# Altium schematic sheet Radio.SchDoc
size A4; SheetNumber: 4; SheetTotal: 5
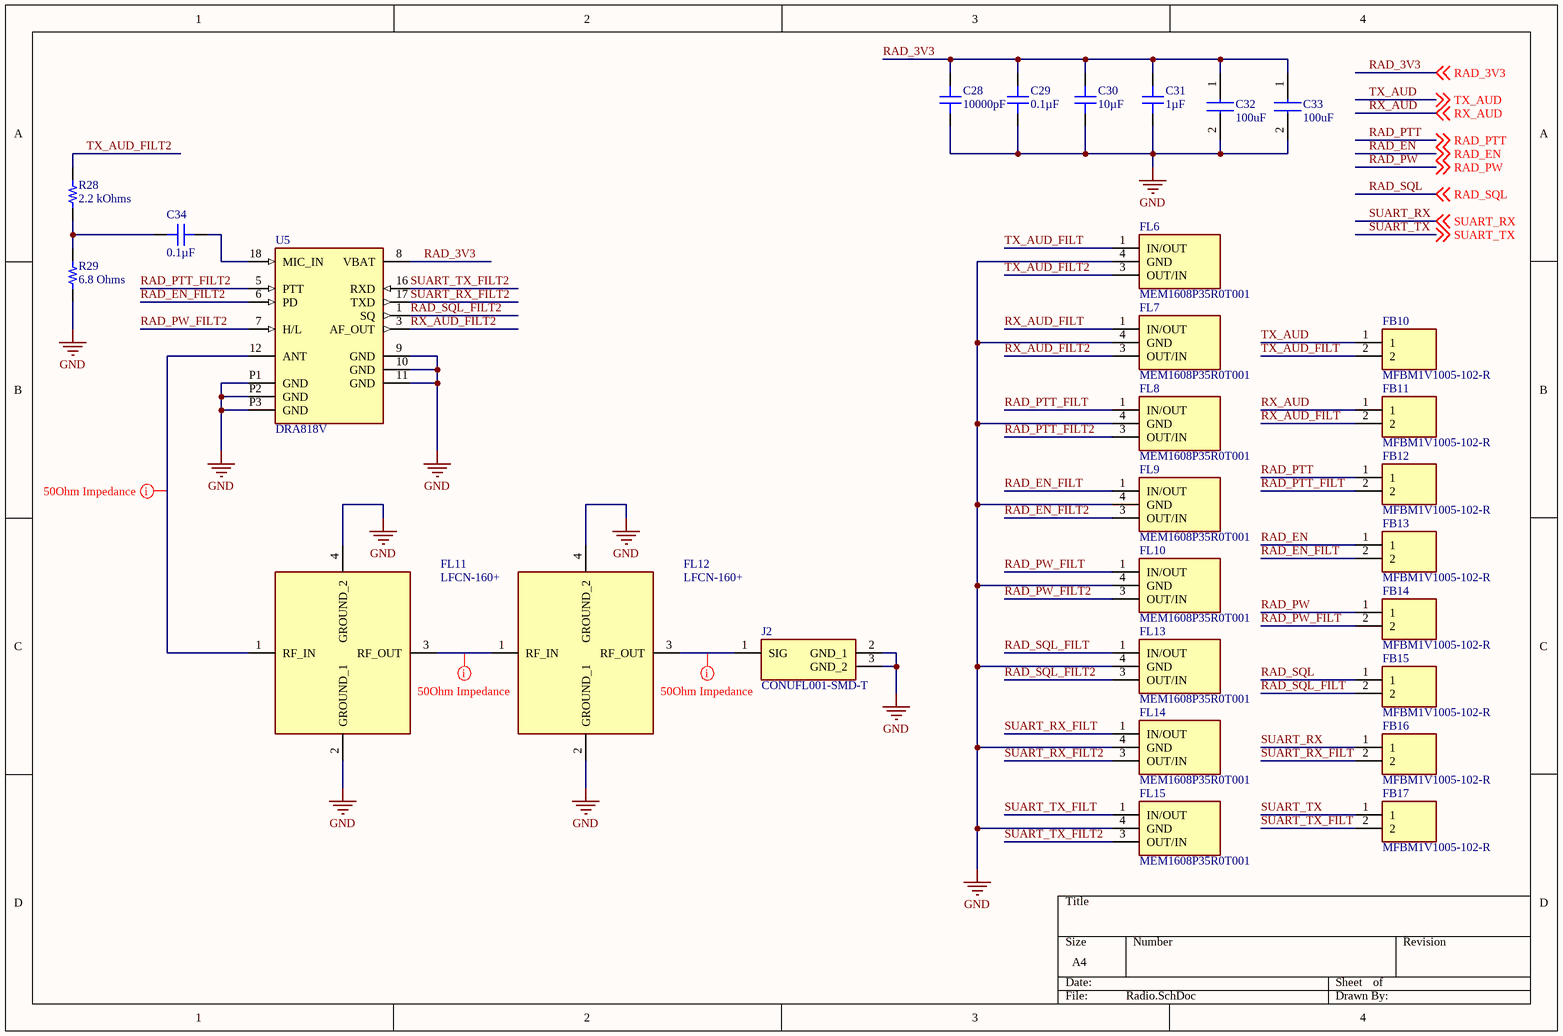
[diagram p0: Radio.SchDoc]

## Parts
C28  10000pF  [CAP 0402_1005]
C29  0.1µF  [CAP 0402_1005]
C30  10µF  [CAP 0402_1005]
C31  1µF  [CAP 0402_1005]
C32  100uF  [CAPC3225X270N]
C33  100uF  [CAPC3225X270N]
C34  0.1µF  [CAP 0402_1005]
FB10  MFBM1V1005-102-R  [BEADC1005X65N]
FB11  MFBM1V1005-102-R  [BEADC1005X65N]
FB12  MFBM1V1005-102-R  [BEADC1005X65N]
FB13  MFBM1V1005-102-R  [BEADC1005X65N]
FB14  MFBM1V1005-102-R  [BEADC1005X65N]
FB15  MFBM1V1005-102-R  [BEADC1005X65N]
FB16  MFBM1V1005-102-R  [BEADC1005X65N]
FB17  MFBM1V1005-102-R  [BEADC1005X65N]
FL6  MEM1608P35R0T001  [MEM1608P35R0T001]
FL7  MEM1608P35R0T001  [MEM1608P35R0T001]
FL8  MEM1608P35R0T001  [MEM1608P35R0T001]
FL9  MEM1608P35R0T001  [MEM1608P35R0T001]
FL10  MEM1608P35R0T001  [MEM1608P35R0T001]
FL11  LFCN-160+  [LFCN160]
FL12  LFCN-160+  [LFCN160]
FL13  MEM1608P35R0T001  [MEM1608P35R0T001]
FL14  MEM1608P35R0T001  [MEM1608P35R0T001]
FL15  MEM1608P35R0T001  [MEM1608P35R0T001]
J2  CONUFL001-SMD-T  [CONUFL001-SMD]
R28  2.2 kOhms  [RES 0402_1005]
R29  6.8 Ohms  [RES 0402_1005]
U5  DRA818V  [DORJI_DRA818V]

## Nets
GND: C28.1 C29.1 C30.1 C31.1 C32.2 C33.2 FL6.4(GND) FL7.4(GND) FL8.4(GND) FL9.4(GND) FL10.4(GND) FL11.2(GROUND_1) FL11.4(GROUND_2) FL12.2(GROUND_1) FL12.4(GROUND_2) FL13.4(GND) FL14.4(GND) FL15.4(GND) J2.2(GND_1) J2.3(GND_2) R29.1 U5.9(GND) U5.10(GND) U5.11(GND) U5.P1(GND) U5.P2(GND) U5.P3(GND)
RAD_3V3: C28.2 C29.2 C30.2 C31.2 C32.1 C33.1 U5.8(VBAT) ; off-sheet RAD_3V3
RAD_EN: FB13.1 ; off-sheet RAD_EN
RAD_EN_FILT: FB13.2 FL9.1(IN/OUT)
RAD_EN_FILT2: FL9.3(OUT/IN) U5.6(PD)
RAD_PTT: FB12.1 ; off-sheet RAD_PTT
RAD_PTT_FILT: FB12.2 FL8.1(IN/OUT)
RAD_PTT_FILT2: FL8.3(OUT/IN) U5.5(PTT)
RAD_PW: FB14.1 ; off-sheet RAD_PW
RAD_PW_FILT: FB14.2 FL10.1(IN/OUT)
RAD_PW_FILT2: FL10.3(OUT/IN) U5.7(H/L)
RAD_SQL: FB15.1 ; off-sheet RAD_SQL
RAD_SQL_FILT: FB15.2 FL13.1(IN/OUT)
RAD_SQL_FILT2: FL13.3(OUT/IN) U5.1(SQ)
RX_AUD: FB11.1 ; off-sheet RX_AUD
RX_AUD_FILT: FB11.2 FL7.1(IN/OUT)
RX_AUD_FILT2: FL7.3(OUT/IN) U5.3(AF_OUT)
SUART_RX: FB16.1 ; off-sheet SUART_RX
SUART_RX_FILT: FB16.2 FL14.1(IN/OUT)
SUART_RX_FILT2: FL14.3(OUT/IN) U5.17(TXD)
SUART_TX: FB17.1 ; off-sheet SUART_TX
SUART_TX_FILT: FB17.2 FL15.1(IN/OUT)
SUART_TX_FILT2: FL15.3(OUT/IN) U5.16(RXD)
TX_AUD: FB10.1 ; off-sheet TX_AUD
TX_AUD_FILT: FB10.2 FL6.1(IN/OUT)
TX_AUD_FILT2: FL6.3(OUT/IN) R28.1
NetC34_1: C34.1 U5.18(MIC_IN)
NetC34_2: C34.2 R28.2 R29.2
NetFL11_1: FL11.1(RF_IN) U5.12(ANT)
NetFL11_3: FL11.3(RF_OUT) FL12.1(RF_IN)
NetFL12_3: FL12.3(RF_OUT) J2.1(SIG)

## Layout directives
net class Z50Ohm: NetFL11_1, NetFL11_3, NetFL12_3

## Library data of the parts
C28 = 0402B103K500CT: CAP CER 10000PF 50V X7R 0402; Manufacturer: Walsin Technology Corporation; Tolerance: ±10%; Part Number: 0402B103K500CT; Value: 10000pF; Applications: General Purpose; Capacitance: 10000pF; ComponentLink1Description: Datasheet; ComponentLink1URL: http://www.passivecomponent.com/wp-content/uploads/2018/10/MLCC.pdf; ComponentLink2Description: DigiKey Link; ComponentLink2URL: http://digikey.com/product-detail/en/walsin-technology-corporation/0402B103K500CT/1292-1628-1-ND/9355632; Device Package: 0402 (1005 Metric); LastUpdated: 2/9/2020 1:02:02 AM; Lifecycle Status: Active; Minimum Order: 1; Mounting Type: Surface Mount, MLCC; Operating Temperature: -55°C ~ 125°C; Package / Case: 0402 (1005 Metric); Packaging: CutTape; PartId: 11631; Part Status: Active; Price: 0.10; Series: -; Size / Dimension: 0.039" L x 0.020" W (1.00mm x 0.50mm); Supplier 1: DigiKey; Supplier Part Number 1: 1292-1628-1-ND; Temperature Coefficient: X7R; Thickness (Max): 0.022" (0.55mm); Voltage - Rated: 50V
C29 C34 = C0402C104K9PACTU: CAP CER 0.1UF 6.3V X5R 0402; Manufacturer: KEMET; Tolerance: ±10%; Part Number: C0402C104K9PACTU; Value: 0.1µF; Applications: General Purpose; Capacitance: 0.1µF; ComponentLink1Description: Datasheet; ComponentLink1URL: https://api.kemet.com/component-edge/download/datasheet/C0402C104K9PACTU.pdf; ComponentLink2Description: DigiKey Link; ComponentLink2URL: http://digikey.com/product-detail/en/kemet/C0402C104K9PACTU/399-3026-1-ND/447602; Device Package: 0402 (1005 Metric); LastUpdated: 2/9/2020 1:01:34 AM; Lifecycle Status: Active; Minimum Order: 1; Mounting Type: Surface Mount, MLCC; Operating Temperature: -55°C ~ 85°C; Package / Case: 0402 (1005 Metric); Packaging: TapeAndReel; PartId: 12742; Part Status: Active; Price: 0.01; Series: SMD Comm X5R; Size / Dimension: 0.039" L x 0.020" W (1.00mm x 0.50mm); Supplier 1: DigiKey; Supplier Part Number 1: 399-3026-1-ND; Temperature Coefficient: X5R; Thickness (Max): 0.022" (0.55mm); Voltage - Rated: 6.3V
C30 = C0402C106M9PAC7867: CAP CER 10UF 6.3V X5R 0402; Manufacturer: KEMET; Tolerance: ±20%; Part Number: C0402C106M9PAC7867; Value: 10µF; Applications: General Purpose; Capacitance: 10µF; ComponentLink1Description: Datasheet; ComponentLink1URL: https://api.kemet.com/component-edge/download/datasheet/C0402C106M9PAC7867.pdf; ComponentLink2Description: DigiKey Link; ComponentLink2URL: http://digikey.com/product-detail/en/kemet/C0402C106M9PAC7867/399-13069-1-ND/5767556; Device Package: 0402 (1005 Metric); LastUpdated: 2/9/2020 1:02:21 AM; Lifecycle Status: Active; Minimum Order: 1; Mounting Type: Surface Mount, MLCC; Operating Temperature: -55°C ~ 85°C; Package / Case: 0402 (1005 Metric); Packaging: TapeAndReel; PartId: 3087; Part Status: Active; Price: 0.13; Series: SMD Comm X5R; Size / Dimension: 0.039" L x 0.020" W (1.00mm x 0.50mm); Supplier 1: DigiKey; Supplier Part Number 1: 399-13069-1-ND; Temperature Coefficient: X5R; Thickness (Max): 0.028" (0.70mm); Voltage - Rated: 6.3V
C31 = 0402YD105KAT2A: CAP CER 1UF 16V X5R 0402; Manufacturer: AVX Corporation; Tolerance: ±10%; Part Number: 0402YD105KAT2A; Value: 1µF; Applications: General Purpose; Capacitance: 1µF; ComponentLink1Description: Datasheet; ComponentLink1URL: http://datasheets.avx.com/cx5r.pdf; ComponentLink2Description: DigiKey Link; ComponentLink2URL: http://digikey.com/product-detail/en/avx-corporation/0402YD105KAT2A/478-10179-1-ND/6797606; Device Package: 0402 (1005 Metric); LastUpdated: 2/9/2020 1:02:22 AM; Lifecycle Status: Active; Minimum Order: 1; Mounting Type: Surface Mount, MLCC; Operating Temperature: -55°C ~ 85°C; Package / Case: 0402 (1005 Metric); Packaging: TapeAndReel; PartId: 2859; Part Status: Active; Price: 0.07; Series: -; Size / Dimension: 0.039" L x 0.020" W (1.00mm x 0.50mm); Supplier 1: DigiKey; Supplier Part Number 1: 478-10179-1-ND; Temperature Coefficient: X5R; Thickness (Max): 0.022" (0.55mm); Voltage - Rated: 16V
C32 C33 = GRM32EC70J107ME15L: Capacitor; Manufacturer_Name: Murata Electronics; Datasheet Link: https://componentsearchengine.com//GRM32EC70J107ME15L.pdf; Height: 2.7mm; Mouser2 Part Number: 81-GRM32EC70J107ME5L; Mouser2 Price/Stock: https://www.mouser.com/Search/Refine.aspx?Keyword=81-GRM32EC70J107ME5L; Manufacturer_Part_Number: GRM32EC70J107ME15L
FB10-FB17 = MFBM1V1005-102-R: Ferrite Bead; Manufacturer_Name: Eaton; Manufacturer_Part_Number: MFBM1V1005-101-R; Assembly Instruction: DNP; Datasheet Link: https://www.mouser.in/datasheet/2/87/eaton_mfbm1v1005_high_current_multilayer_ferrite_c-1890673.pdf; Height: 0.65mm
FL6-FL10 FL13-FL15 = MEM1608P35R0T001: Filter; Manufacturer_Name: TDK; Datasheet Link: https://product.tdk.com/system/files/dam/doc/product/emc/emc/3tf/catalog/3tf_commercial_signal_mem1608p_en.pdf; Height: 0.7mm; Manufacturer_Part_Number: MEM1608P35R0T001
FL11 FL12 = LFCN-160+: Filter; Manufacturer_Name: Mini-Circuits; Datasheet Link: https://www.minicircuits.com/pdfs/LFCN-160+.pdf; Height: 0.94mm; Manufacturer_Part_Number: LFCN-160+
J2 = CONUFL001-SMD-T: Connector; Manufacturer_Name: Linx Technologies; Datasheet Link: https://componentsearchengine.com//CONUFL001-SMD-T.pdf; Mouser2 Part Number: 712-CONUFL001-SMD-T; Mouser2 Price/Stock: https://www.mouser.com/Search/Refine.aspx?Keyword=712-CONUFL001-SMD-T; Manufacturer_Part_Number: CONUFL001-SMD-T
R28 = CPF0402B2K2E1: RES SMD 2.2K OHM 0.1% 1/16W 0402; Manufacturer: TE Connectivity Passive Product; Power (Watts): 0.063W, 1/16W; Temperature Coefficient: ±25ppm/°C; Part Number: CPF0402B2K2E1; Value: 2.2 kOhms; ComponentLink1Description: Datasheet; ComponentLink1URL: https://www.te.com/commerce/DocumentDelivery/DDEController?Action=srchrtrv&DocNm=1773200&DocType=DS&DocLang=English; ComponentLink2Description: DigiKey Link; ComponentLink2URL: http://digikey.com/product-detail/en/te-connectivity-passive-product/CPF0402B2K2E1/A102766CT-ND/2729299; Composition: Thin Film; Device Package: 0402 (1005 Metric); Height - Seated (Max): 0.014" (0.35mm); LastUpdated: 2/9/2020 1:08:09 AM; Lifecycle Status: Active; Minimum Order: 1; Number of Terminations: 2; Operating Temperature: -55°C ~ 155°C; Package / Case: 0402 (1005 Metric); Packaging: TapeAndReel; PartId: 3342; Part Status: Active; Price: 0.14; Resistance: 2.2 kOhms; Series: CPF, Neohm; Size / Dimension: 0.039" L x 0.020" W (1.00mm x 0.50mm); Supplier 1: DigiKey; Supplier Part Number 1: A102766CT-ND; Supplier Device Package: 0402; Tolerance: ±0.1%
R29 = ERJ-2GEJ6R8X: RES SMD 6.8 OHM 5% 1/10W 0402; Manufacturer: Panasonic Electronic Components; Power (Watts): 0.1W, 1/10W; Temperature Coefficient: -100/ +600ppm/°C; Part Number: ERJ-2GEJ6R8X; Value: 6.8 Ohms; ComponentLink1Description: Datasheet; ComponentLink1URL: https://b2b-api.panasonic.eu/file_stream/pids/fileversion/1242; ComponentLink2Description: DigiKey Link; ComponentLink2URL: http://digikey.com/product-detail/en/panasonic-electronic-components/ERJ-2GEJ6R8X/P6.8JCT-ND/282384; Composition: Thick Film; Device Package: 0402 (1005 Metric); Features: Automotive AEC-Q200; Height - Seated (Max): 0.016" (0.40mm); LastUpdated: 2/9/2020 1:08:02 AM; Lifecycle Status: Active; Minimum Order: 1; Number of Terminations: 2; Operating Temperature: -55°C ~ 155°C; Package / Case: 0402 (1005 Metric); Packaging: CutTape; PartId: 6342; Part Status: Active; Price: 0.10; Ratings: AEC-Q200; Resistance: 6.8 Ohms; Series: ERJ; Size / Dimension: 0.039" L x 0.020" W (1.00mm x 0.50mm); Supplier 1: DigiKey; Supplier Part Number 1: P6.8JCT-ND; Supplier Device Package: 0402; Tolerance: ±5%
U5 = DRA818V: VHF Band Voice Transceiver Module; MF: DORJI; Price: None; Check_prices: https://www.snapeda.com/parts/DRA818V/DORJI/view-part/2654524/?ref=eda; SnapEDA_Link: https://www.snapeda.com/parts/DRA818V/DORJI/view-part/2654524/?ref=snap; Package: Package; Availability: Unavailable; MP: DRA818V; Value: *